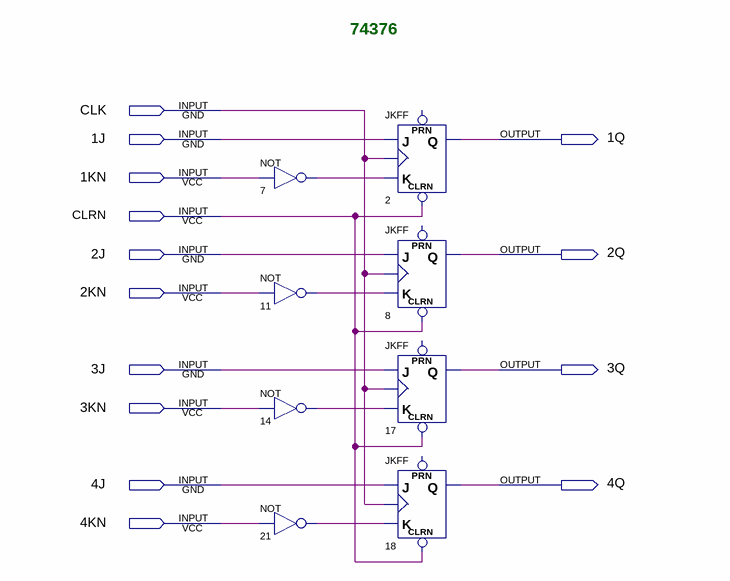
[diagram p0: schematic sheet]
// Quartus schematic 74376.bdf as structural Verilog: 8 symbols, 14 pins
module \74376  (
  input  CLK,
  input  \1J ,
  input  \1KN ,
  input  CLRN,
  input  \2J ,
  input  \2KN ,
  input  \3J ,
  input  \3KN ,
  input  \4J ,
  input  \4KN ,
  output \1Q ,
  output \2Q ,
  output \3Q ,
  output \4Q 
);

  wire n7_out, n11_out, n14_out, n21_out;

  not u_7 (n7_out, \1KN );
  not u_11 (n11_out, \2KN );
  not u_14 (n14_out, \3KN );
  not u_21 (n21_out, \4KN );
  JKFF u_2 (.CLRN(CLRN), .K(n7_out), .J(\1J ), .CLK(CLK), .Q(\1Q ));  // open: PRN
  JKFF u_8 (.CLRN(CLRN), .K(n11_out), .J(\2J ), .CLK(CLK), .Q(\2Q ));  // open: PRN
  JKFF u_17 (.CLRN(CLRN), .K(n14_out), .J(\3J ), .CLK(CLK), .Q(\3Q ));  // open: PRN
  JKFF u_18 (.CLRN(CLRN), .K(n21_out), .J(\4J ), .CLK(CLK), .Q(\4Q ));  // open: PRN

  // Notes on the sheet:
  //   74376
endmodule
